# Altium schematic sheet Sheet1.SchDoc
size A4; SheetNumber: 1; SheetTotal: 1
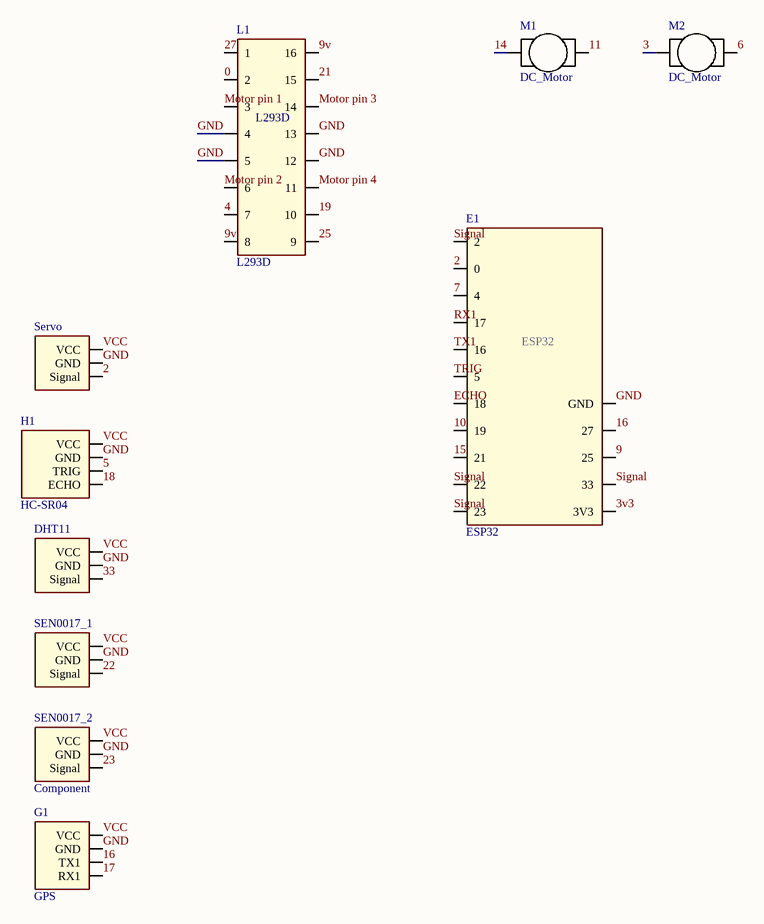
[diagram p0: Sheet1.SchDoc]

## Parts
DHT11  Component  (value not drawn)
E1  ESP32
G1  GPS
H1  HC-SR04
L1  L293D
M1  DC_Motor
M2  DC_Motor
SEN0017_1  Component  (value not drawn)
SEN0017_2  Component
Servo  Component  (value not drawn)

## Nets
0: L1.2
2: E1.0 Servo.2(Signal)
3: M2.1
3v3: E1.3V3
4: L1.7
5: H1.2(TRIG)
6: M2.0
7: E1.4
9: E1.25
9v: L1.8 L1.16
10: E1.19
11: M1.0
14: M1.1
15: E1.21
16: E1.27 G1.2(TX1)
17: G1.3(RX1)
18: H1.3(ECHO)
19: L1.10
21: L1.15
22: SEN0017_1.2(Signal)
23: SEN0017_2.2(Signal)
25: L1.9
27: L1.1
33: DHT11.2(Signal)
ECHO: E1.18
GND: DHT11.1(GND) E1.GND G1.1(GND) H1.1(GND) L1.4 L1.5 L1.12 L1.13 SEN0017_1.1(GND) SEN0017_2.1(GND) Servo.1(GND)
Motor pin 1: L1.3
Motor pin 2: L1.6
Motor pin 3: L1.14
Motor pin 4: L1.11
RX1: E1.17
Signal: E1.2 E1.22 E1.23 E1.33
TRIG: E1.5
TX1: E1.16
VCC: DHT11.0(VCC) G1.0(VCC) H1.0(VCC) SEN0017_1.0(VCC) SEN0017_2.0(VCC) Servo.0(VCC)